# EAGLE design SingleBoardVersion (EAGLE 6.1)
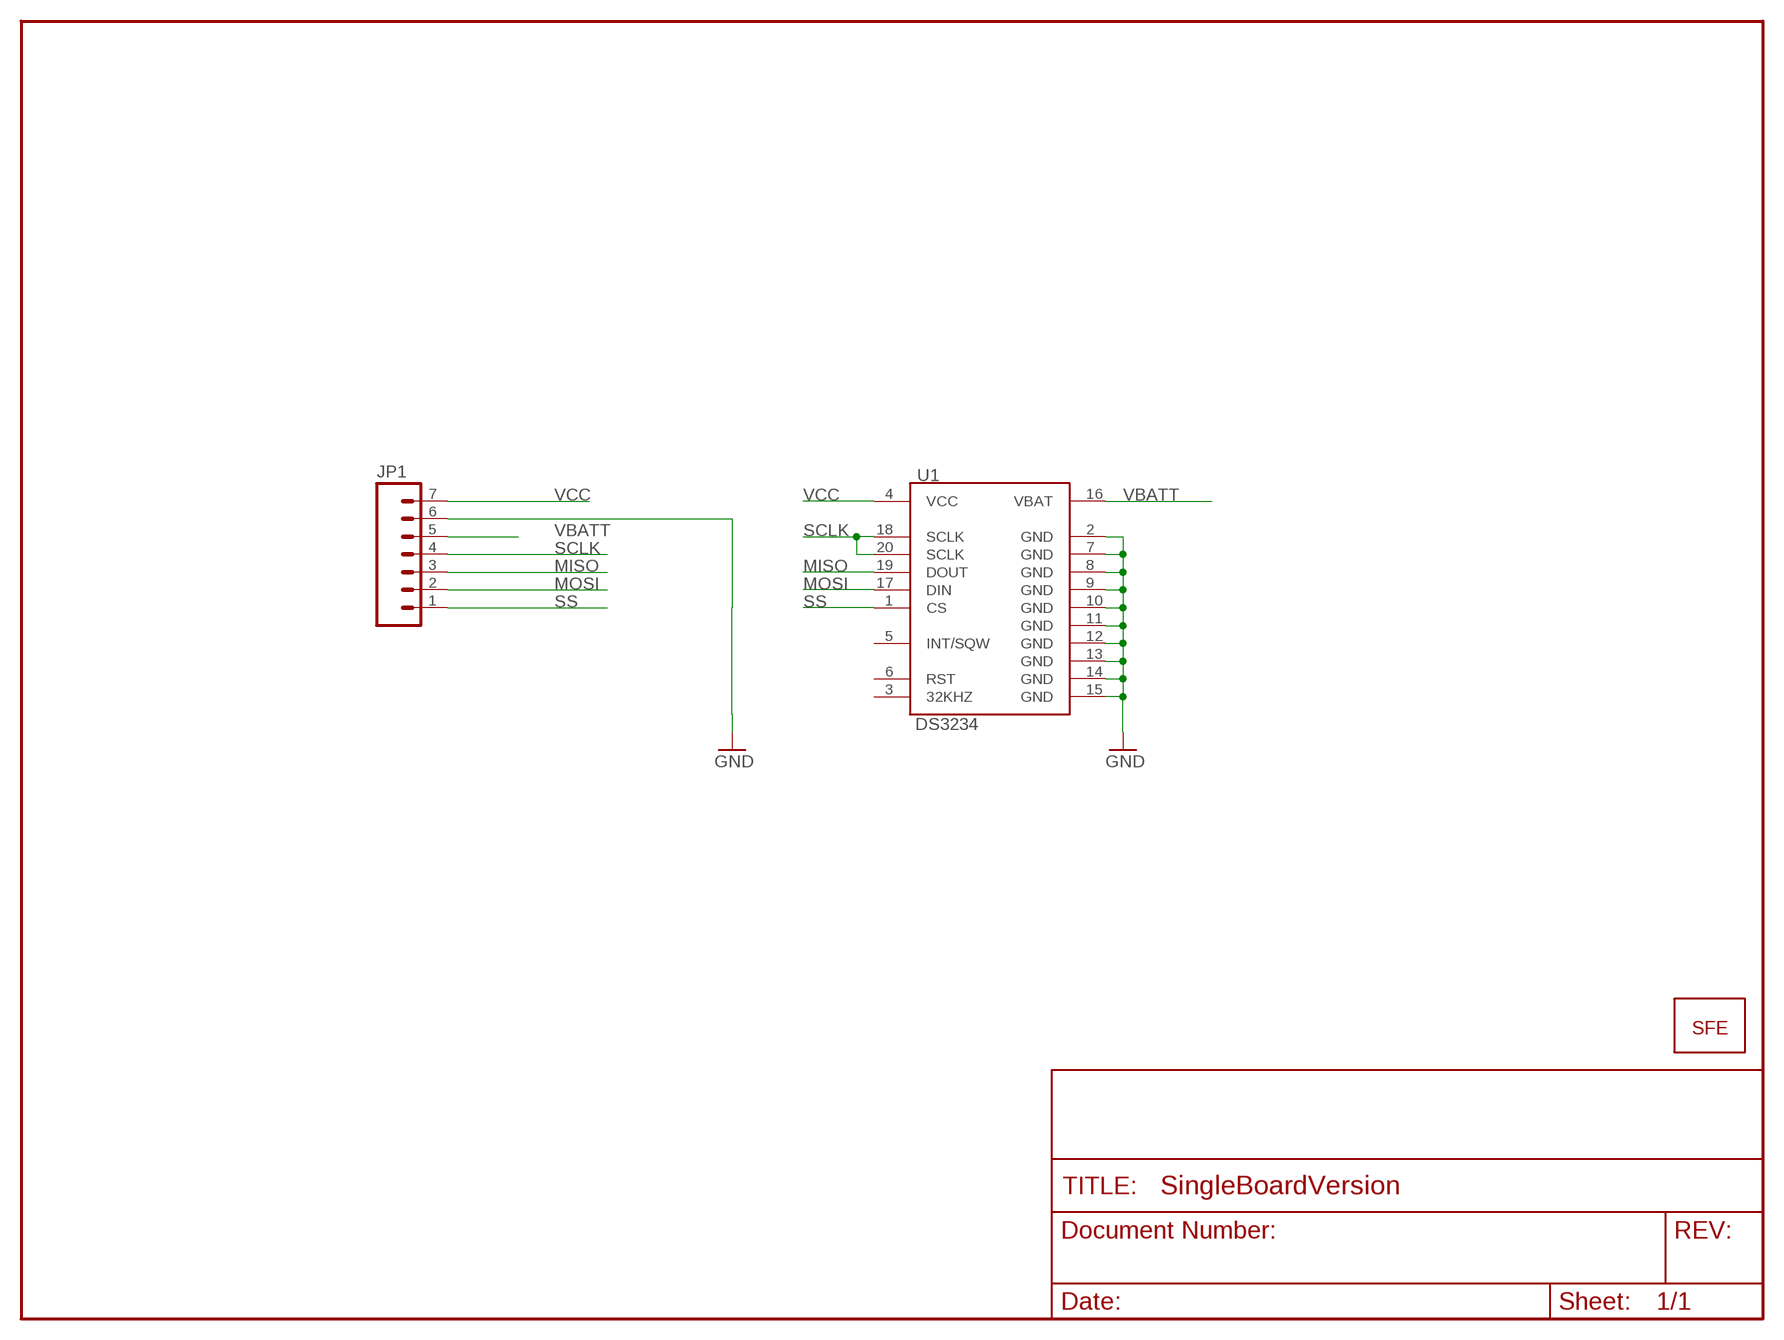
[diagram p0: schematic, sheet 1]

## Parts
JP1  M07  [1X07]
JP2  LOGO-SFESK  [SFE-LOGO-FLAME]
U1  DS3234  [DS3234]

## Nets
GND: JP1.6 U1.2(GND) U1.7(GND) U1.8(GND) U1.9(GND) U1.10(GND) U1.11(GND) U1.12(GND) U1.13(GND) U1.14(GND) U1.15(GND)
MISO: JP1.3 U1.19(DOUT)
MOSI: JP1.2 U1.17(DIN)
SCLK: JP1.4 U1.18(SCLK) U1.20(SCLK)
SS: JP1.1 U1.1(CS)
VBATT: JP1.5 U1.16(VBAT)
VCC: JP1.7 U1.4(VCC)
Unconnected: U1.3(32KHZ) U1.5(INT/SQW) U1.6(RST)

## Library data of the parts
JP1 = SparkFun:M07: Header 7 Standard 7-pin 0.1" header. Use with straight break away headers (SKU : PRT-00116), right angle break away headers (PRT-00553), swiss pins (PRT-00743), machine pins (PRT-00117), and female headers (PRT-00115). NOTES ON THE VARIANTS LOCK and LOCK_LONGPADS... This footprint was designed to help hold the alignment of a through-hole component (i.e. 7-pin header) while soldering it into place. You may notice that each hole has been shifted either up or down by 0.005 of an inch from it's more standard position (which is usually a perfectly straight line). This slight alteration caused the pins (the squares in the middle) to touch the edges of the holes. Because they are alternating, it causes a "brace" to hold the header in place. 0.005 has proven to be the perfect amount of "off-center" position when using our standard breakaway headers. Although looks a little odd when you look at the bare footprint, once you have a header in there, the alteration is very hard to notice. Also, if you push a header all the way into place, it is covered up entirely on the bottom side. This idea of altering the position of holes to aid alignment will be further integrated into the Sparkfun Library for other footprints. It can help hold any component with 3 or more connection pins.
JP2 = SparkFun:LOGO-SFE: Spark Fun Electronics PCB Logo This is the standard Spark Fun Electronics PCB logo.
U1 = SparkFun:DS3234: DS3234 Real Time Clock

## Board
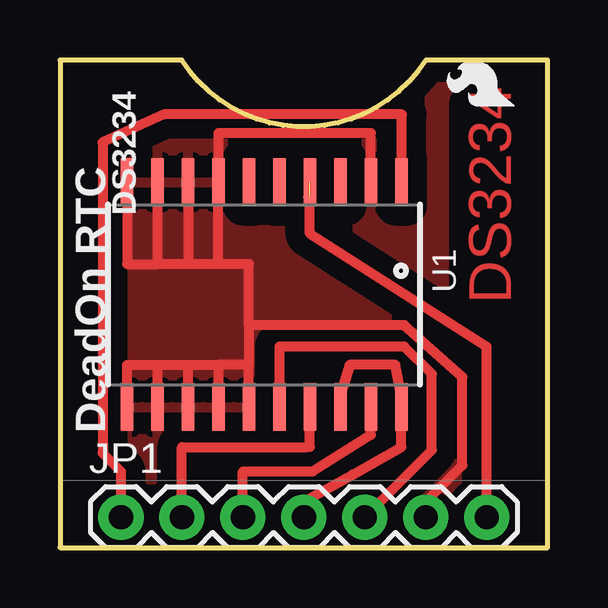
[diagram p1: board, top side]
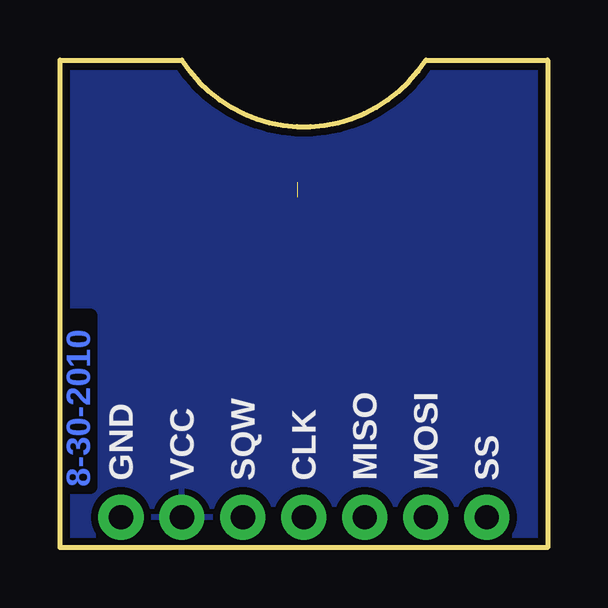
[diagram p2: board, bottom side, seen from below]

Size 20.32 x 20.32 mm. Coordinates in mm from the lower left corner, seen from the top.
Outline: 0,0 20.32,0 20.32,20.32 15.24,20.32 arc-115 5.08,20.32 0,20.32 0,0
Copper layers (1*16): Top 0.035mm / dielectric 1.5mm / Bottom 0.035mm
Design rules: minimum track width 8mil, minimum drill 20mil, track to track 8mil, track to pad 8mil, pad to pad 8mil, via to via 8mil, smd to smd 8mil, copper to edge 8mil, drill to drill 8mil, minimum pad ring 12mil, minimum via ring 10mil, stop-mask expansion 4mil, vias tented up to drill 20mil, thermal gap 10mil

### Footprints (pad centres in the part's own frame; a part is rotated, then mirrored left to right if it is on the bottom)
1X07 = drill 1.016 pad 1.88: 1 0,0; 2 2.54,0; 3 5.08,0; 4 7.62,0; 5 10.16,0; 6 12.7,0; 7 15.24,0
DS3234 = smd 0.53 x 1.98: 1 -5.715,-4.685; 2 -4.445,-4.685; 3 -3.175,-4.685; 4 -1.905,-4.685; 5 -0.635,-4.685; 6 0.635,-4.685; 7 1.905,-4.685; 8 3.175,-4.685; 9 4.445,-4.685; 10 5.715,-4.685; 11 5.715,4.685; 12 4.445,4.685; 13 3.175,4.685; 14 1.905,4.685; 15 0.635,4.685; 16 -0.635,4.685; 17 -1.905,4.685; 18 -3.175,4.685; 19 -4.445,4.685; 20 -5.715,4.685

### Placement (x,y rotation side)
JP1  2.54,1.27 0 top
JP2  18.92,18.41 90 top
U1  8.51,10.54 180 top
U2  CREATIVE_COMMONS  [CREATIVE_COMMONS]  -17.78,-8.89 0 top  (outside the outline)

### Tracks (layer width: path | path; a pad name or v marks a point on that pad's centre or on a via)
GND
  Top 0.305: 7.87,7.62 U1.15 | 4.06,11.81 5.33,11.81 6.6,11.81 | 5.33,7.62 5.46,7.62
  Top 0.406: JP1.6 15.24,1.91 16.76,3.43 16.76,7.11 14.35,9.27 7.87,9.27 | 7.87,9.27 7.87,7.62 | 7.87,9.27 7.87,11.81 6.6,11.81 | 6.6,11.81 U1.7 6.6,17.27 12.95,17.27 U1.2 | U1.10 2.79,11.81 4.06,11.81 | 6.6,11.81 5.33,11.81 | 5.33,11.81 4.06,11.81 | 4.06,11.81 4.06,14.73 | U1.8 5.33,11.81 | U1.15 7.87,7.62 | 7.87,7.62 6.6,7.62 | 6.6,7.62 U1.14 | U1.13 5.33,7.62 4.06,7.62 | 5.46,7.62 6.6,7.62 | U1.12 4.06,7.62 | U1.11 2.79,7.62 4.06,7.62
  pour Bottom (isolate 0.305): 0,20.32 0,0 20.32,0 20.32,20.32
  pour Top (isolate 0.813): 0,20.32 20.32,20.32 20.32,0 0,0
MISO
  Top 0.406: U1.19 12.95,4.7 10.54,3.17 7.62,3.17 JP1.3
MOSI
  Top 0.254: 10.29,4.19 10.41,4.19
  Top 0.406: 10.41,4.19 U1.17 | 10.29,4.19 5.08,4.19 JP1.2
SCLK
  Top 0.254: U1.20 14.22,6.35 | 11.68,6.35 U1.18
  Top 0.406: 14.22,6.35 13.97,7.62 12.06,7.62 11.68,6.35 | JP1.4 10.16,1.91 12.19,3.05 14.22,4.19 U1.20
SS
  Top 0.305: U1.1 14.25,14.59
  Top 0.406: 14.25,14.59 14.25,18.06 4.34,18.06 1.78,16.89 1.78,3.94 2.54,3.17 JP1.1
VBATT
  Top 0.406: JP1.5 15.49,4.06 15.49,7.24 14.35,8.38 9.14,8.38 U1.16
VCC  (1 unrouted)
  Top 0.305: 10.41,14.61 10.29,14.61
  Top 0.406: JP1.7 17.78,8.38 10.41,13.08 10.41,14.61

### Text on the board
Top: DS3234
Bottom: 8-30-2010
tPlace: DeadOn RTC | DS3234
bPlace: SS | MOSI | MISO | CLK | SQW | VCC | GND
bNames: Hilary Hoops